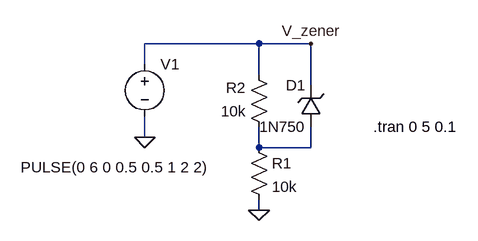
[diagram p0: schematic Draft3.asc]
Draft3.asc, the LTspice schematic file:
Version 4.1
SHEET 1 880 680
WIRE 192 64 16 64
WIRE 272 64 192 64
WIRE 16 96 16 64
WIRE 192 112 192 64
WIRE 272 128 272 64
WIRE 16 208 16 176
WIRE 192 224 192 192
WIRE 272 224 272 192
WIRE 272 224 192 224
WIRE 192 320 192 304
FLAG 192 320 0
FLAG 16 208 0
FLAG 272 64 V_zener
SYMBOL zener 288 192 R180
WINDOW 0 24 64 Left 2
WINDOW 3 24 0 Left 2
SYMATTR InstName D1
SYMATTR Value 1N750
SYMBOL res 176 208 R0
SYMATTR InstName R1
SYMATTR Value 10k
SYMBOL res 208 208 R180
WINDOW 0 36 76 Left 2
WINDOW 3 36 40 Left 2
SYMATTR InstName R2
SYMATTR Value 10k
SYMBOL voltage 16 80 R0
WINDOW 3 -191 174 Left 2
WINDOW 123 0 0 Left 0
WINDOW 39 0 0 Left 0
SYMATTR InstName V1
SYMATTR Value PULSE(0 6 0 0.5 0.5 1 2 2)
TEXT 368 192 Left 2 !.tran 0 5 0.1

The netlist it stands for:
* Draft3.asc
D1 N001 V_zener 1N750
R1 N001 0 10k
R2 N001 V_zener 10k
V1 V_zener 0 PULSE(0 6 0 0.5 0.5 1 2 2)
.model D D
.lib standard.dio
.tran 0 5 0.1
.backanno
.end